# EAGLE design StickIt-Template (EAGLE 5.11)
AUTHOR: Dave Vandenbout / XESS Corp.; COPYRIGHT: 2013 XESS Corp.; VERSION#: 1.0
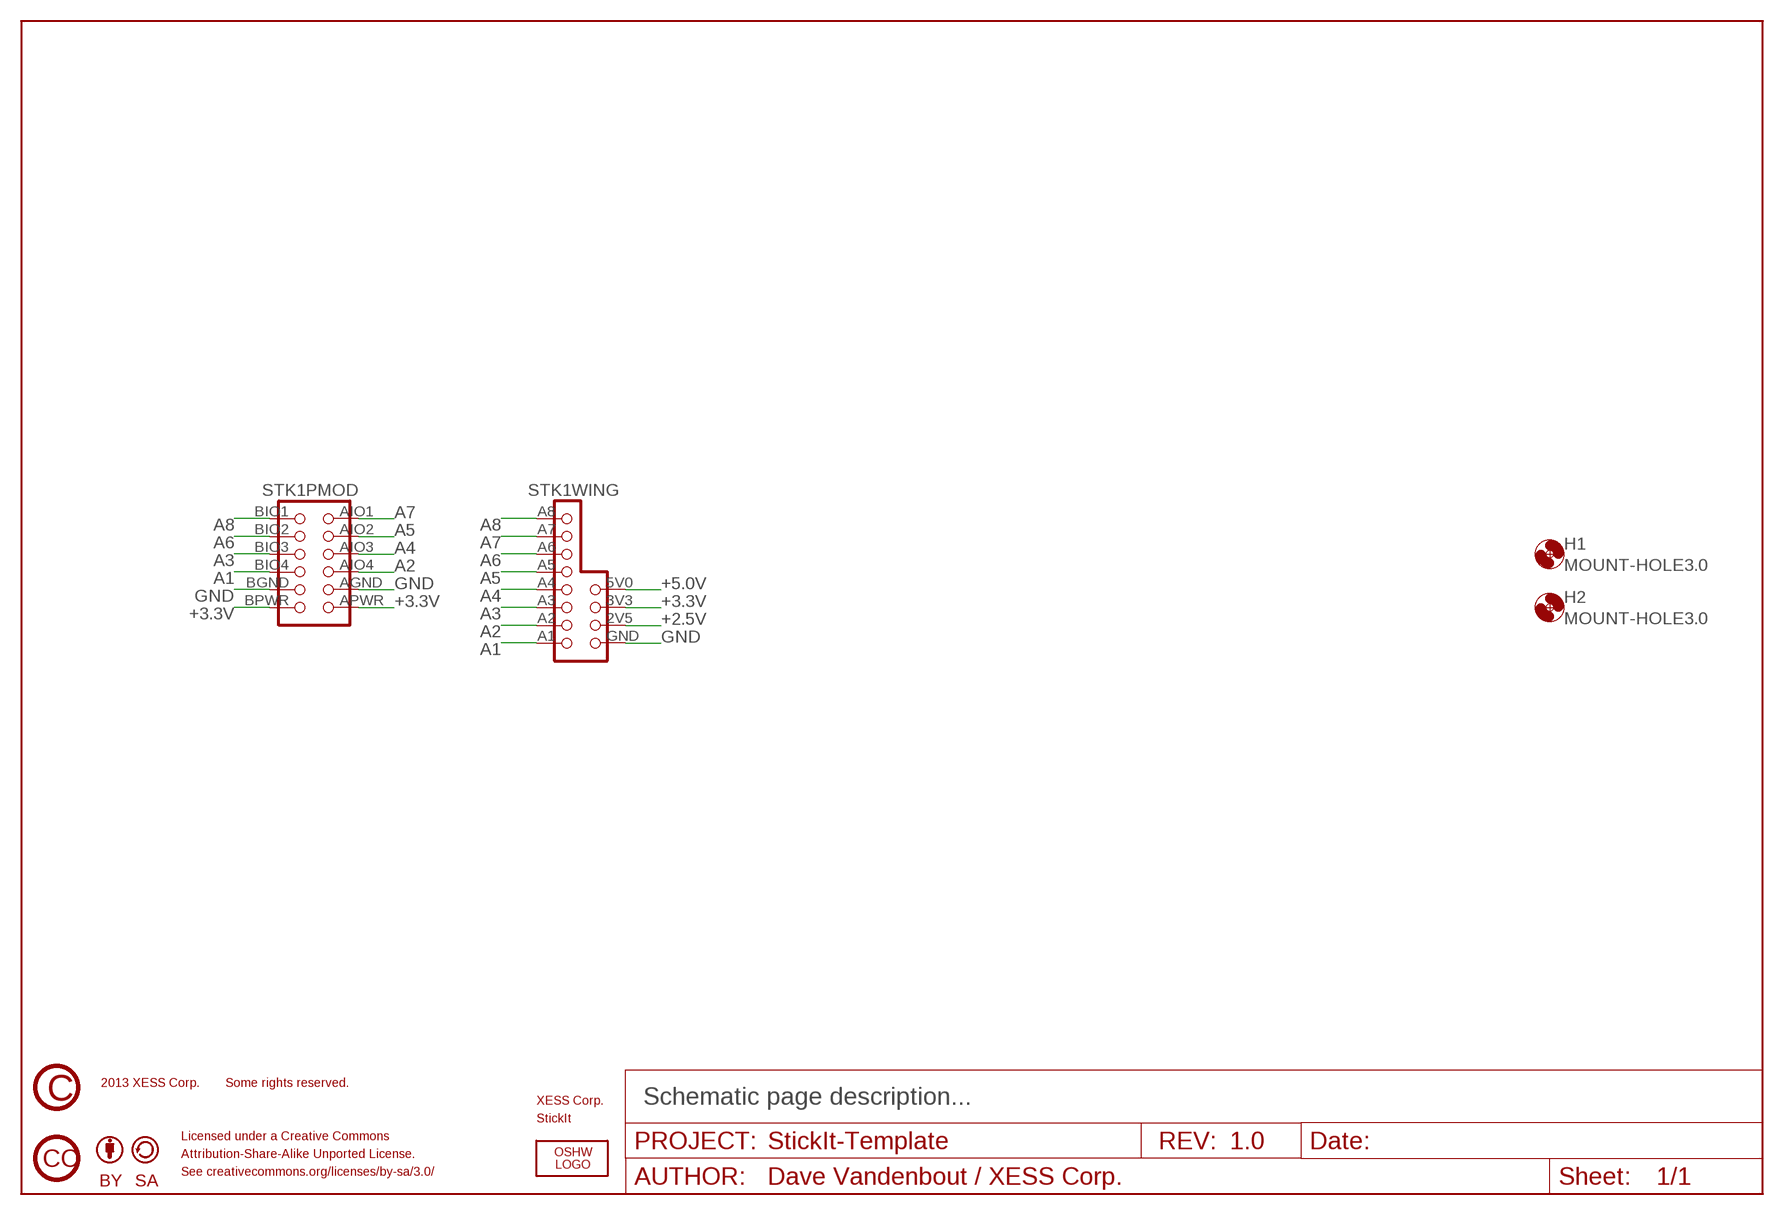
[diagram p0: schematic, sheet 1]

## Parts
H1  MOUNT-HOLE3.0  [3,0]
H2  MOUNT-HOLE3.0  [3,0]
LOGO1  OSHW_LOGO_FILLX0200-NT  [OSHW_FILLX200_NOTEXT]
STK1  STICKIT-HEADER  STICKIT-HEADER1  [STICKIT-HEADER1]
U$1  LOGO-STICKIT700X200  [LOGO-STICKIT-700X200]
U$2  CC_CC  [CC_CC]
U$3  CC_BY  [CC_BY]
U$4  CC_SA  [CC_SA]
U$5  CC_COPYRIGHT  [CC_COPYRIGHT]
U$6  LOGO-XESS  LOGO-XESS700X120  [LOGO-XESS-700X120]

## Nets
+2.5V: STK1.2V5(WING:2V5)
+3.3V: STK1.3V3(WING:3V3) STK1.APWR(PMOD:APWR) STK1.BPWR(PMOD:BPWR)
+5.0V: STK1.5V0(WING:5V)
A1: STK1.A1(WING:A1) STK1.BIO4(PMOD:BIO4)
A2: STK1.A2(WING:A2) STK1.AIO4(PMOD:AIO4)
A3: STK1.A3(WING:A3) STK1.BIO3(PMOD:BIO3)
A4: STK1.A4(WING:A4) STK1.AIO3(PMOD:AIO3)
A5: STK1.A5(WING:A5) STK1.AIO2(PMOD:AIO2)
A6: STK1.A6(WING:A6) STK1.BIO2(PMOD:BIO2)
A7: STK1.A7(WING:A7) STK1.AIO1(PMOD:AIO1)
A8: STK1.A8(WING:A8) STK1.BIO1(PMOD:BIO1)
GND: STK1.AGND(PMOD:AGND) STK1.BGND(PMOD:BGND) STK1.GND(WING:GND)

## Notes on the sheet
- Some rights reserved.
- Schematic page description...
- Licensed under a Creative Commons
- Attribution-Share-Alike Unported License.
- See creativecommons.org/licenses/by-sa/3.0/

## Library data of the parts
H1 H2 = holes:MOUNT-HOLE: MOUNTING HOLE with drill center marker
LOGO1 = oshw-logo:OSHW_LOGO_FILL
STK1 = xess:STICKIT-HEADER: StickIt Header Combined PMOD and Papilio Wing header for use on StickIt add-on boards.
U$1 = xess:LOGO-STICKIT
U$2 = xess:CC_CC
U$3 = xess:CC_BY
U$4 = xess:CC_SA
U$5 = xess:CC_COPYRIGHT
U$6 = xess:LOGO-XESS

## Net classes
1 power: clearance 0.254 mm

## Board
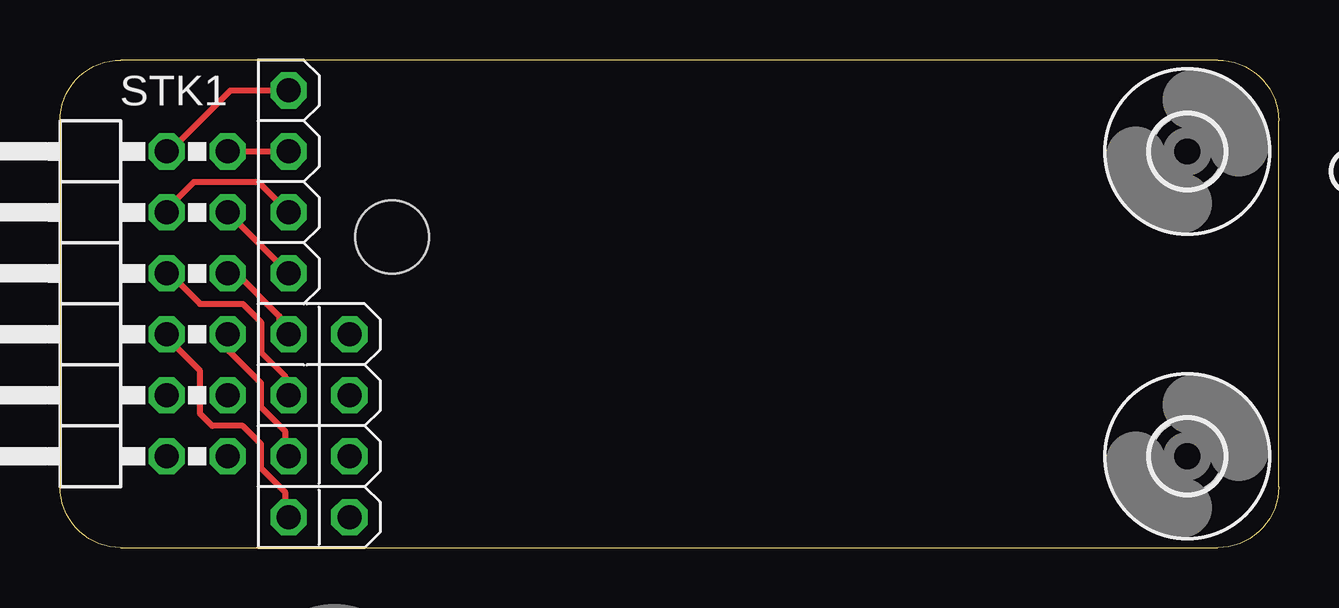
[diagram p1: board, top side]
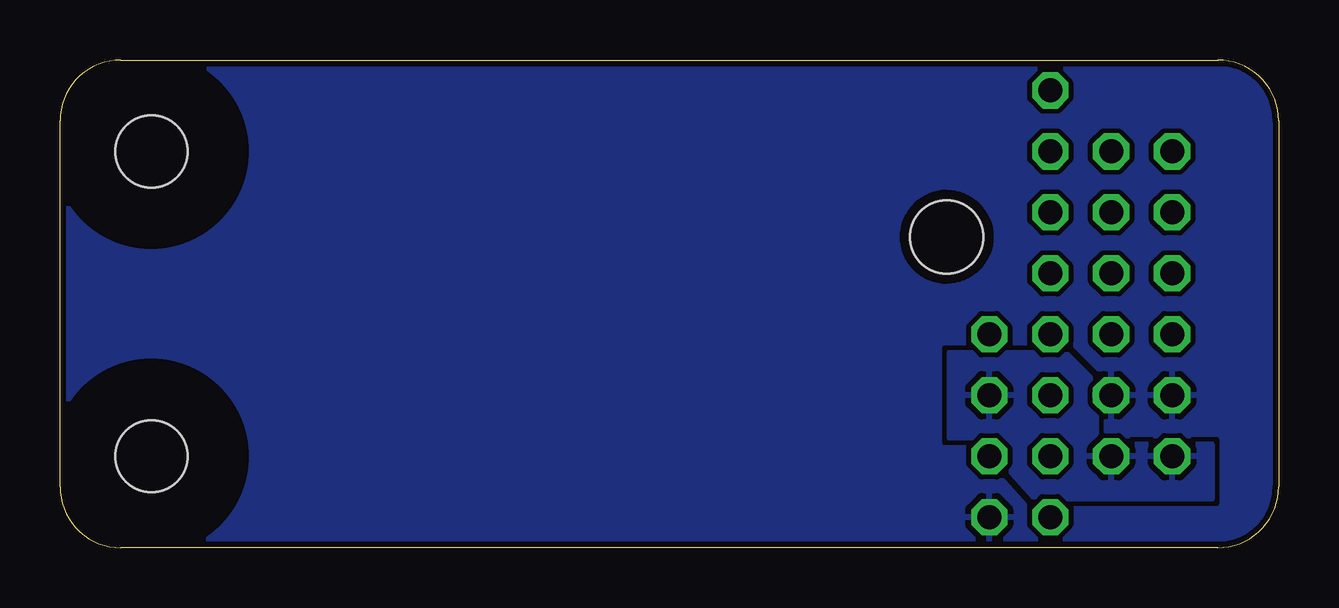
[diagram p2: board, bottom side, seen from below]

Size 50.8 x 20.32 mm. Coordinates in mm from the lower left corner, seen from the top.
Outline: 2.54,0 48.26,0 arc90 50.8,2.54 50.8,17.78 arc90 48.26,20.32 2.54,20.32 arc90 0,17.78 0,2.54 arc90 2.54,0
Copper layers (1*16): Top 0.035mm / dielectric 1.5mm / Bottom 0.035mm
Design rules "ITeadstudio_safe": minimum track width 8mil, minimum drill 12mil, track to track 8mil, track to pad 8mil, pad to pad 8mil, via to via 8mil, smd to smd 0mil, copper to edge 10mil, drill to drill 10mil, minimum pad ring 10mil, minimum via ring 8mil, stop-mask expansion 2mil, vias tented up to drill 100mil, thermal gap 10mil

### Footprints (pad centres in the part's own frame; a part is rotated, then mirrored left to right if it is on the bottom)
3,0 = hole 3: 0,0
STICKIT-HEADER1 = drill 1 octagon: 2V5 5.08,-15.24; 3V3 5.08,-12.7; 5V0 5.08,-10.16; A1 2.54,-17.78; A2 2.54,-15.24; A3 2.54,-12.7; A4 2.54,-10.16; A5 2.54,-7.62; A6 2.54,-5.08; A7 2.54,-2.54; A8 2.54,0; AGND 0,-12.7; AIO1 0,-2.54; AIO2 0,-5.08; AIO3 0,-7.62; AIO4 0,-10.16; APWR 0,-15.24; BGND -2.54,-12.7; BIO1 -2.54,-2.54; BIO2 -2.54,-5.08; BIO3 -2.54,-7.62; BIO4 -2.54,-10.16; BPWR -2.54,-15.24; GND 5.08,-17.78 | hole 3.048: 6.858,-6.096

### Placement (x,y rotation side)
H1  46.99,3.81 0 top
H2  46.99,16.51 0 top
LOGO1  73.66,6.6 0 top  (outside the outline)
STK1  6.99,19.05 0 top
U$1  53.34,5.08 0 top
U$2  11.43,-14.61 0 top  (outside the outline)
U$3  18.41,-13.34 0 top  (outside the outline)
U$4  23.5,-13.34 0 top  (outside the outline)
U$5  11.43,-5.71 0 top  (outside the outline)
U$6  53.34,0 0 top

### Tracks (layer width: path | path; a pad name or v marks a point on that pad's centre or on a via)
+3.3V
  pour Bottom: 2.79,2.03 10.16,2.03 12.45,4.57 13.72,4.57 13.72,8.13 8.89,8.13 7.62,6.86 7.62,4.32 2.79,4.32
A1
  Top 0.254: STK1.BIO4 4.45,8.76 5.84,7.37 5.84,5.59 6.35,5.08 7.62,5.08 8.38,4.32 8.38,3.3 9.4,2.29 9.4,1.4 STK1.A1
A2
  Top 0.254: STK1.AIO4 6.99,8.26 8.38,6.86 8.38,5.84 9.4,4.83 9.4,3.94 STK1.A2
A3
  Top 0.254: STK1.BIO3 4.57,11.43 5.84,10.16 7.62,10.16 8.38,9.4 8.38,8.13 9.4,7.11 9.4,6.48 STK1.A3
A4
  Top 0.254: STK1.AIO3 7.37,11.43 9.14,9.65 9.14,9.27 STK1.A4
A5
  Top 0.254: STK1.AIO2 STK1.A5
A6
  Top 0.254: STK1.BIO2 4.45,14.1 5.59,15.24 8.26,15.24 STK1.A6
A7
  Top 0.254: STK1.AIO1 STK1.A7
A8
  Top 0.254: STK1.BIO1 4.57,16.51 7.11,19.05 STK1.A8
GND
  pour Bottom (rank 6): 0,0 0,20.32 50.8,20.32 50.8,0

### Text on the board
tPlace: c | OSHW
tDocu: Some rights reserved. | Licensed under a Creative Commons | Attribution-Share-Alike Unported License. | See creativecommons.org/licenses/by-sa/3.0/